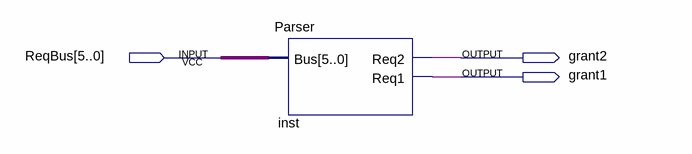
[diagram p0: schematic sheet]
// Quartus schematic Arbitr.bdf as structural Verilog: 1 symbols, 3 pins
module Arbitr (
  input  [5:0] ReqBus,
  output grant2,
  output grant1
);

  Parser inst (.Bus(ReqBus), .Req2(grant2), .Req1(grant1));
endmodule
